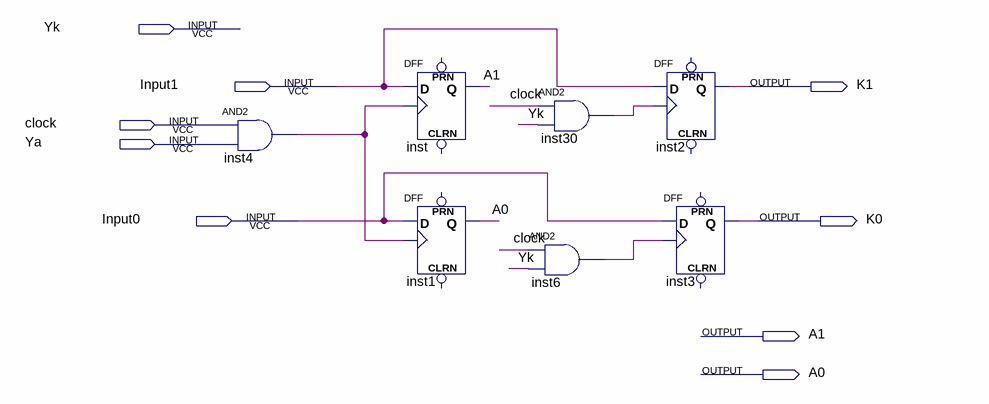
[diagram p0: schematic sheet]
// Quartus schematic registerArgumanKey.bdf as structural Verilog: 7 symbols, 9 pins
module registerArgumanKey (
  input  Yk,
  input  Input1,
  input  clock,
  input  Ya,
  input  Input0,
  output K1,
  output K0,
  output A1,
  output A0
);

  wire inst4_out, inst6_out, inst30_out;

  and inst4 (inst4_out, clock, Ya);
  DFF inst (.CLK(inst4_out), .D(Input1), .Q(A1));  // open: CLRN, PRN
  DFF inst1 (.CLK(inst4_out), .D(Input0), .Q(A0));  // open: CLRN, PRN
  and inst30 (inst30_out, clock, Yk);
  and inst6 (inst6_out, clock, Yk);
  DFF inst2 (.CLK(inst30_out), .D(Input1), .Q(K1));  // open: CLRN, PRN
  DFF inst3 (.CLK(inst6_out), .D(Input0), .Q(K0));  // open: CLRN, PRN
endmodule
